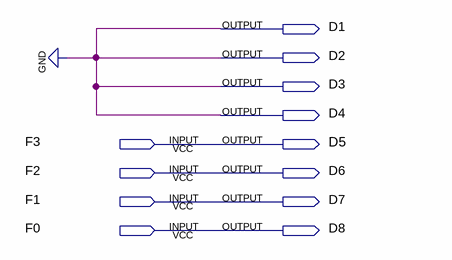
[diagram p0: schematic sheet]
// Quartus schematic conv_completo_1_digito.bdf as structural Verilog: 0 symbols, 12 pins
module conv_completo_1_digito (
  input  F3,
  input  F2,
  input  F1,
  input  F0,
  output D1,
  output D2,
  output D3,
  output D4,
  output D5,
  output D6,
  output D7,
  output D8
);


  assign D1 = 1'b0;
  assign D2 = 1'b0;
  assign D3 = 1'b0;
  assign D4 = 1'b0;
  assign D5 = F3;
  assign D6 = F2;
  assign D7 = F1;
  assign D8 = F0;
endmodule
